# Altium project ESP 32 BANG TAI.PrjPcb
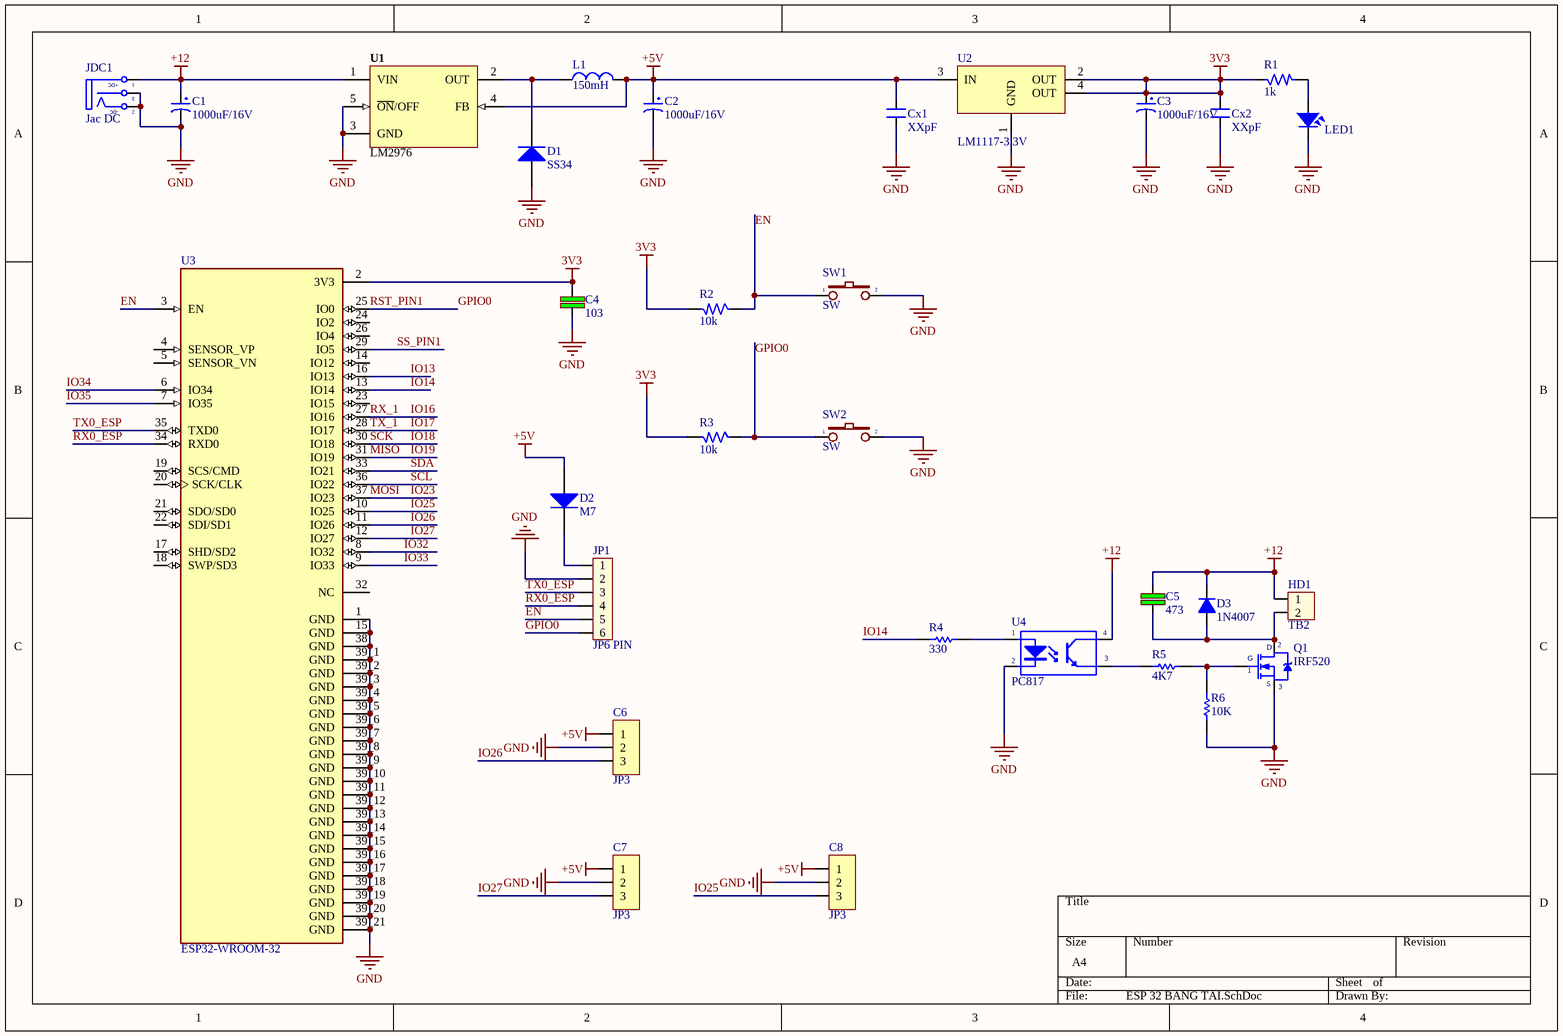
[diagram p0: ESP 32 BANG TAI.SchDoc]
1 sheet, 31 parts. Net scope: global (net labels, ports and power ports of the same name join across sheets).
Board file: ESP 32 BANG TAI.PcbDoc

## Sheet ESP 32 BANG TAI.SchDoc
size A4

### Parts
C1  1000uF/16V  [CP1.5/3.4]
C2  1000uF/16V  [CP1.5/3.4]
C3  1000uF/16V  [CP1.5/3.4]
C4  103  [SM-1206]
C5  473  [CN3]
C6  JP3  [JP3-D1T]
C7  JP3  [JP3-D1T]
C8  JP3  [JP3-D1T]
Cx1  XXpF  [CN-SMD-1206]
Cx2  XXpF  [CN-SMD-1206]
D1  SS34  [DIODE SMA]
D2  M7  [DIODE SMA]
D3  1N4007  [D1A]
HD1  TB2  [HED2T]
JDC1  Jac DC  [DC-IN]
JP1  JP6 PIN  [JP6]
L1  150mH  [L01]
LED1  LED SMD  [SM-LED-1206-Blue]  (value not drawn)
Q1  IRF520  [QTO-220]
R1  1k  [SM-RES-1206]
R2  10k  [SM-RES-1206]
R3  10k  [SM-RES-1206]
R4  value 330  [R1/4W]  (hidden comment: Res1)
R5  value 4K7  [R1/4W]  (hidden comment: Res1)
R6  value 10K  [R1/4W]  (hidden comment: Res1)
SW1  SW  [SW1-SMD]
SW2  SW  [SW1-SMD]
U1  LM2976  [DIP5]
U2  LM1117-3.3V  [SOT223-4.CAOVANHUONG]
U3  ESP32-WROOM-32  [MODULE_ESP32-WROOM-32]
U4  PC817  [DIP4/W0.3]

### Nets
3V3: C3.1 C4.1 Cx2.2 R1.1 R2.2 R3.2 U2.2(OUT) U2.4(OUT) U3.2(3V3)
+5V: C2.1 C6.1 C7.1 C8.1 Cx1.2 D2.1(A) L1.2 U1.4(FB) U2.3(IN)
+12: C1.1 C5.2 D3.2(K) HD1.1 JDC1.1(T) U1.1(VIN) U4.4(C)
GND: C1.2 C2.2 C3.2 C4.2 C6.2 C7.2 C8.2 Cx1.1 Cx2.1 D1.1(A) JDC1.2(TN) JDC1.3(S) JP1.2 LED1.2 Q1.3(S) R6.1 SW1.2 SW2.2 U1.3(GND) U1.5(~{ON}/OFF) U2.1(GND) U3.1(GND) U3.15(GND) U3.38(GND) U3.39_1(GND) U3.39_2(GND) U3.39_3(GND) U3.39_4(GND) U3.39_5(GND) U3.39_6(GND) U3.39_7(GND) U3.39_8(GND) U3.39_9(GND) U3.39_10(GND) U3.39_11(GND) U3.39_12(GND) U3.39_13(GND) U3.39_14(GND) U3.39_15(GND) U3.39_16(GND) U3.39_17(GND) U3.39_18(GND) U3.39_19(GND) U3.39_20(GND) U3.39_21(GND) U4.2(K)
EN: JP1.5 R2.1 SW1.1 U3.3(EN)
GPIO0: JP1.6 R3.1 SW2.1 U3.25(IO0)  [also labelled RST_PIN1]
IO13: U3.16(IO13)
IO14: R4.1 U3.13(IO14)
IO16: U3.27(IO16)  [also labelled RX_1]
IO17: U3.28(IO17)  [also labelled TX_1]
IO18: U3.30(IO18)  [also labelled SCK]
IO19: U3.31(IO19)  [also labelled MISO]
IO23: U3.37(IO23)  [also labelled MOSI]
IO25: C8.3 U3.10(IO25)
IO26: C6.3 U3.11(IO26)
IO27: C7.3 U3.12(IO27)
IO32: U3.8(IO32)
IO33: U3.9(IO33)
IO34: U3.6(IO34)
IO35: U3.7(IO35)
RX0_ESP: JP1.4 U3.34(RXD0)
SCL: U3.36(IO22)
SDA: U3.33(IO21)
SS_PIN1: U3.29(IO5)
TX0_ESP: JP1.3 U3.35(TXD0)
NetC5_1: C5.1 D3.1(A) HD1.2 Q1.2(D)
NetD1_2: D1.2(K) L1.1 U1.2(OUT)
NetD2_2: D2.2(K) JP1.1
NetLED1_1: LED1.1 R1.2
NetQ1_1: Q1.1(G) R5.2 R6.2
NetR4_2: R4.2 U4.1(A)
NetR5_1: R5.1 U4.3(E)

Not connected (* = marked no-connect by the designer): U3 4(SENSOR_VP) 5(SENSOR_VN) 14(IO12) 17(SHD/SD2) 18(SWP/SD3) 19(SCS/CMD) 20(SCK/CLK) 21(SDO/SD0) 22(SDI/SD1) 23(IO15) 24(IO2) 26(IO4) 32(NC)

### Notes on the sheet
- (in symbol DCIN) +DC; -DC

### Library data of the parts
C1-C3 = CP4: Cap 1000uF/16V - 220uF/50V; Description 5: 4,7uF>10uF/250V_3,3uF>10uF/400V - 2,2uF>4,7uF/450V; Description 1: 2200uF-3300uF/6,3V - 1000uF-2200uF/10V; Description 2: 1000uF/16V - 470uF => 1000uF/25V - 100uF/100V; Description 3: 330uF>470uF/35V_220uF>470uF/50V_10uF>22uF/250V; Description 4: 220uF => 330uF/63V - 10uF =>33uF/160 - 200V; Value: 1000uF/16V
C4 = C: Cap SMD; Value: 103
C5 = CN3: Cap np W0.3; Value: 0,047uF; Copyright: VanDungEvn
C6-C8 = JP3: WR-PHD 2.54 mm Angled Socket Header; Manufacturer: W¨¹rth Elektronik eiSos GmbH; partNo: 613003143121; ComponentLink1 Description: Manufacturer; ComponentLink2 Description: Datasheet; NoPins: 03; Created Date: 29 March 2013; ComponentLink1URL: http://www.we-online.com; ComponentLink2URL: http://katalog.we-online.de/em/datasheet/6130xx143121.pdf; Created by: Karrer Zheng
Cx1 Cx2 = CN: Value: 33pF
D1 = Diode SS34 ( 1N5822 ): Dán; Don_Vi: Con; Ma_Hang: MH002104; Ten_Linh_Kien: Diode SS34 3A 40V SMA ( 1N5822 SS34A); Kieu_Chan: *; Chung_Loai: Dán
D2 = Diode M7 ( 4007 ): Dán; Don_Vi: Con; Ten_Linh_Kien: Diode M7 1N4007 SMD 1A 1000V; Ma_Hang: MH000944; Chung_Loai: Dán; Ghi_Chu: *
D3 = D1A: Diode 1A; Value: 1N4007
HD1 = Hed2: Header 2 (Green); Value: Header 2
JDC1 = DCIN: Jac DC input; Value: Jac DC
JP1 = JP6: Value: JP7
L1 = Inductor: Value: 150 mH
LED1 = LED-SMD-1206
Q1 = IRF840: MOSFET N - CHANNEL 500V - 0.75 - 8A - TO-220; Value: IRF840
R1-R3 = R: Resistor 1/4W; Value: R1/4W - 1K
R4-R6 = Res1_1: Resistor; Manufacturer: Generic Components; Class: Passive; Published: 08/06/2000; Publisher: Altium Hobart Technology Centre; SubClass: Resistor
SW1 SW2 = SW2: Switch button 2 pin; Value: SW chip 2 pin
U1 = LM2596: Max Input Voltage: 12 V; Max Output Current: 3 (6.0 peak) A; Max Output Voltage: mV; Category: IC-Power; Min Input Voltage: mV; Min Output Voltage: mV; Mounting Technology: Surface Mount; Status: Unreleased; Supply Voltage: mV; Temperature Range: -40 to +125 degC
U2 = LM1117: 800mA Low-Dropout Linear Regulator; Creator: Nguyen Ba Bien; Website: http://group3i.net
U3 = ESP32-WROOM-32: Bluetooth, WiFi 802.11b/g/n, Bluetooth v4.2 +EDR, Class 1, 2 and 3 Transceiver Module 2.4GHz ~ 2.5GHz Antenna Not Included, U.FL Surface Mount; MF: Espressif Systems; Price: None; Availability: In Stock; MP: ESP32-WROOM-32; Package: Module Espressif Systems; SnapEDA_Link: https://www.snapeda.com/parts/ESP32-WROOM-32/Espressif+Systems/view-part/?ref=snap; Check_prices: https://www.snapeda.com/parts/ESP32-WROOM-32/Espressif+Systems/view-part/?ref=eda; Value: *; Purchase-URL: https://pricing.snapeda.com/search/part/ESP32-WROOM-32/?ref=eda
U4 = PC817: Single Opto; Value: PC817